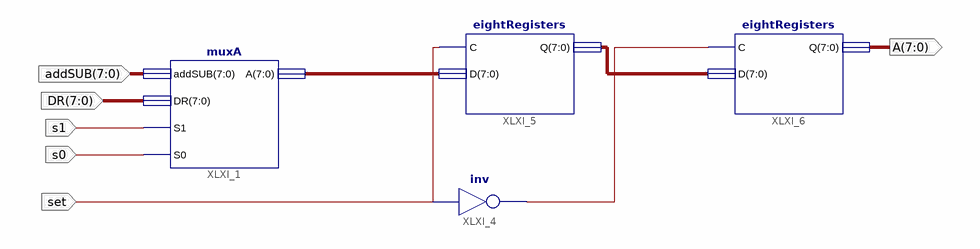
[diagram p0: schematic sheet 1]
// Xilinx ISE schematic A.sch (spartan3e) as structural Verilog: 4 symbols, 6 ports
module A (
  input  set,
  input  s0,
  input  s1,
  input  [7:0] DR,
  input  [7:0] addSUB,
  output [7:0] A
);

  wire XLXN_4;
  wire [7:0] XLXN_1, XLXN_6;

  muxA XLXI_1 (.addSUB(addSUB), .DR(DR), .S1(s1), .S0(s0), .A(XLXN_1));
  not XLXI_4 (XLXN_4, set);
  eightRegisters XLXI_5 (.C(set), .D(XLXN_1), .Q(XLXN_6));
  eightRegisters XLXI_6 (.C(XLXN_4), .D(XLXN_6), .Q(A));
endmodule
